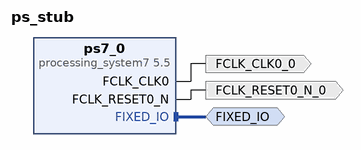
[diagram p0: block diagram of the top level]
# Vivado block design ps_stub, xc7z030sbg485-1, Vivado 2025.2
create_bd_design ps_stub

create_bd_intf_port -mode Master -vlnv xilinx.com:display_processing_system7:fixedio_rtl:1.0 FIXED_IO
create_bd_port -dir O -type clk FCLK_CLK0_0
create_bd_port -dir O -type rst FCLK_RESET0_N_0

create_bd_cell -type ip -vlnv xilinx.com:ip:processing_system7:5.5 ps7_0
set_property -dict [list \
  CONFIG.PCW_FPGA0_PERIPHERAL_FREQMHZ 80 \
  CONFIG.PCW_UIPARAM_DDR_ENABLE 0 \
  CONFIG.PCW_USE_M_AXI_GP0 0 \
] [get_bd_cells ps7_0]
# 35 more settings of ps7_0 are not shown: defaults, MIO pin electricals, DDR timing, and values the tool derives

# ---- connections ----

connect_bd_intf_net [get_bd_intf_ports FIXED_IO] [get_bd_intf_pins ps7_0/FIXED_IO]
connect_bd_net [get_bd_pins ps7_0/FCLK_CLK0] [get_bd_ports FCLK_CLK0_0]
connect_bd_net [get_bd_pins ps7_0/FCLK_RESET0_N] [get_bd_ports FCLK_RESET0_N_0]

validate_bd_design
save_bd_design
